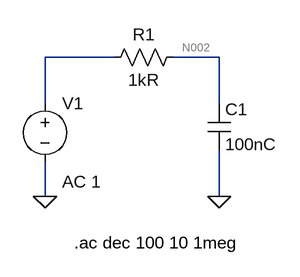
[diagram p0: schematic Draft4.asc]
Draft4.asc, the LTspice schematic file:
Version 4.1
SHEET 1 880 680
WIRE 144 80 48 80
WIRE 288 80 224 80
WIRE 48 144 48 80
WIRE 288 144 288 80
WIRE 48 272 48 224
WIRE 288 272 288 208
FLAG 48 272 0
FLAG 288 272 0
SYMBOL voltage 48 128 R0
WINDOW 123 24 124 Left 2
WINDOW 39 0 0 Left 0
SYMATTR InstName V1
SYMATTR Value ""
SYMATTR Value2 AC 1
SYMBOL res 240 64 R90
WINDOW 0 0 56 VBottom 2
WINDOW 3 32 56 VTop 2
SYMATTR InstName R1
SYMATTR Value 1kR
SYMBOL cap 272 144 R0
SYMATTR InstName C1
SYMATTR Value 100nC
TEXT 88 336 Left 2 !.ac dec 100 10 1meg

The netlist it stands for:
* Draft4.asc
V1 N001 0 AC 1
R1 N002 N001 1kR
C1 N002 0 100nC
.ac dec 100 10 1meg
.backanno
.end

* Results of the author's LTspice run, read from the files saved beside the schematic
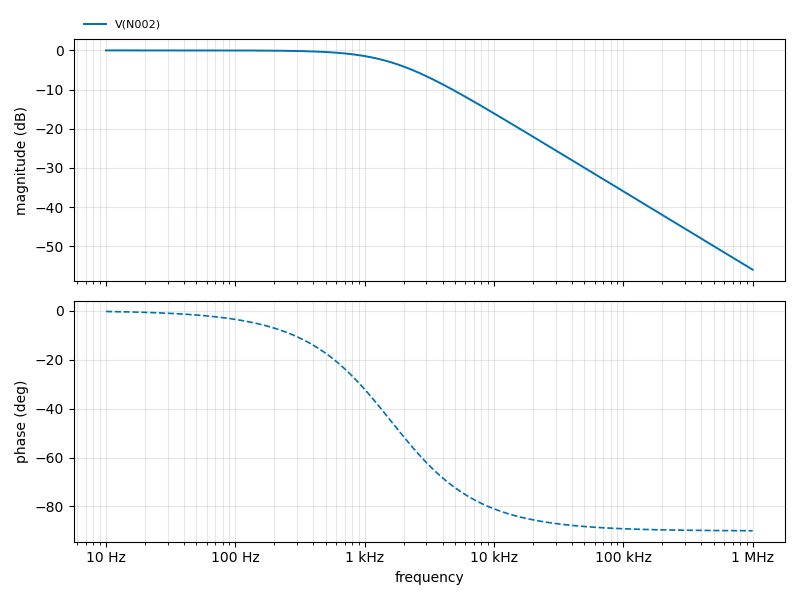
[diagram p1: AC Analysis of Draft4.asc, plotted from the saved traces]
* AC Analysis, 1 run:
*   V(N002): -0.00 dB at 10 Hz, -55.96 dB at 1 MHz, peak -0.00 dB at 10 Hz, 3 dB below the peak at 1.592 kHz